# Altium schematic sheet ModemPower.SchDoc
size A4; Organization: Altium Limited; Address1: L3, 12a Rodborough Rd; Address2: Frenchs Forest; Address3: NSW; Address4: Australia 2086
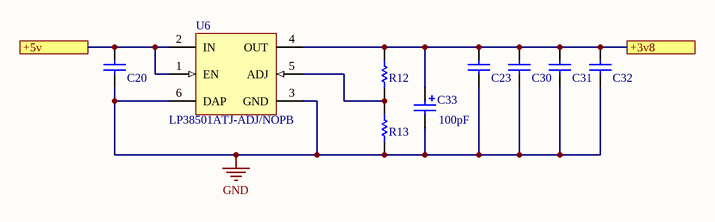
[diagram p0: ModemPower.SchDoc]

## Parts
C20  CAP_1_9  [0402]  (value not drawn)
C23  CAP_1_6  [0402]  (value not drawn)
C30  CAP_1_7  [0402]  (value not drawn)
C31  CAP_1_8  [0402]  (value not drawn)
C32  CAP_1_18  [0402]  (value not drawn)
C33  value 100pF  [POLAR0.8]
R12  RES_37  [0402]  (value not drawn)
R13  RES_37  [0402]  (value not drawn)
U6  LP38501ATJ-ADJ/NOPB  [TJ5A_N]

## Ports
+3v8, +5v

## Nets
GND: C20.1 C23.1 C30.1 C31.1 C32.1 C33.2 R13.1 U6.3(GND) U6.6(DAP)
+3v8: C23.2 C30.2 C31.2 C32.2 C33.1 R12.2 U6.4(OUT) ; port +3v8
+5v: C20.2 U6.1(EN) U6.2(IN) ; port +5v
NetR12_1: R12.1 R13.2 U6.5(ADJ)

## Notes on the sheet
- Title
- Size:
- Date:
- A4
- Number:
- Time:
- Revision:
- Sheet
- of
- File:

## Library data of the parts
C20 = CAP_1_9: 10uF 20% 16V; Tolerance: 20%; Value: 10uF; Voltage: 16V
C23 = CAP_1_6: 100nF 20% 16V; Tolerance: 20%; Value: 100nF; Voltage: 16V
C30 = CAP_1_7: 10nF 10% 50V; Tolerance: 10%; Value: 10nF; Voltage: 50V
C31 = CAP_1_8: 68pF 5% 50V; Tolerance: 5%; Value: 68pF; Voltage: 50V
C32 = CAP_1_18: 16pF 5% 50V; Tolerance: 5%; Value: 16pF; Voltage: 50V
C33 = Cap Pol2: Polarized Capacitor (Axial); Manufacturer: KEMET; Manufacturer Part Number: T520B107M006ATE015; Description: CAP TANT POLY 100UF 6.3V 1411; Dielectric Material: Tantalum; Capacitance: 100uF; Tolerance: 20%; ESR (Equivalent Series Resistance): 15mR; Voltage Rating: 6.3V; Polarity: Polar; Dissipation Factor: 8%; Leakage Current: 63uA; Life (Hours): 2000Hour; Published: 8-Jun-2000; LatestRevisionDate: 17-Jul-2002; LatestRevisionNote: Re-released for DXP Platform.; PackageReference: POLAR0.8; Publisher: Altium Limited; PackageDescription: Polarized Capacitor; 2 Leads; Supplier 1: Digi-Key; Supplier Part Number 1: 399-5306-2-ND; Stock 1: 0; Pricing 1: 2000=0.49686, 4000=0.4901 (USD); Mount: Surface Mount; Case/Package: 1411; Number of Pins: 2; Case Code (Metric): 3528; Case Code (Imperial): 1411; Min Operating Temperature: -55°C; Max Operating Temperature: 105°C; Packaging: Tape and Reel; Package Quantity: 1; Voltage Rating (DC): 6.3V; Termination: SMD/SMT; Voltage: 6.3V; Features: General Purpose; Length: 3.5mm; Height: 1.9mm; Depth: 2.8mm; Width: 0.11inch; Height - Seated (Max): 0.083inch; Radiation Hardening: No; REACH SVHC: No SVHC; ComponentLink1URL: https://content.kemet.com/datasheets/KEM_T2076_T52X-530.pdf; ComponentLink1Description: https://content.kemet.com/datasheets/KEM_T2076_T52X-530.pdf; ComponentLink2URL: http://uk.rs-online.com/webdocs/1515/0900766b815155fb.pdf; ComponentLink2Description: http://uk.rs-online.com/webdocs/1515/0900766b815155fb.pdf; ComponentLink3URL: http://www.mouser.com/ds/2/212/KEM_T2015_T520-368569.pdf; ComponentLink3Description: http://www.mouser.com/ds/2/212/KEM_T2015_T520-368569.pdf; ComponentLink4URL: http://www.farnell.com/datasheets/1759391.pdf; ComponentLink4Description: http://www.farnell.com/datasheets/1759391.pdf
R12 R13 = RES_37: RES 4.7K 0.1W ±5% 0603 (1608); Power: *; Tolerance: *; Value: *
U6 = LP38501ATJ-ADJ/NOPB: 3A FlexCap Low Dropout Linear Regulator for 2.7V to 5.5V Inputs, 5-pin TO-263 Thin, Pb-Free; Manufacturer: National Semiconductor; PackageTopMarking: NSUZXYTTE#*LP38501A*TJ-ADJ; PowerWise: N; CompType: LDO IC; High-Reliability: Y; DatasheetVersion: May-2008; PackageVersion: revE, Jan-2008; PackageReference: TJ5A; PackageDescription: Thin TO-263, Molded, 9.85 x 10.16 x 2mm Body, 5 Lead, 1.7mm Pitch, Surface Mount; PartNumber: LP38501ATJ-ADJ/NOPB; RoHS: Y; PinCount: 5; ComponentLink1Description: Manufacturer URL; ComponentLink1URL: http://www.national.com/; ComponentLink2Description: LP38501-ADJ Datasheet; ComponentLink2URL: http://www.national.com/ds/LP/LP38501-ADJ.pdf; ComponentLink3Description: LP38501-ADJ Web Page; ComponentLink3URL: http://www.national.com/pf/LP/LP38501-ADJ.html; ComponentLink4Description: TJ5A Package Page; ComponentLink4URL: http://www.national.com/packaging/folders/tj5a.html